# EAGLE schematic xtal_2nd_mixer (EAGLE 7.2.0)
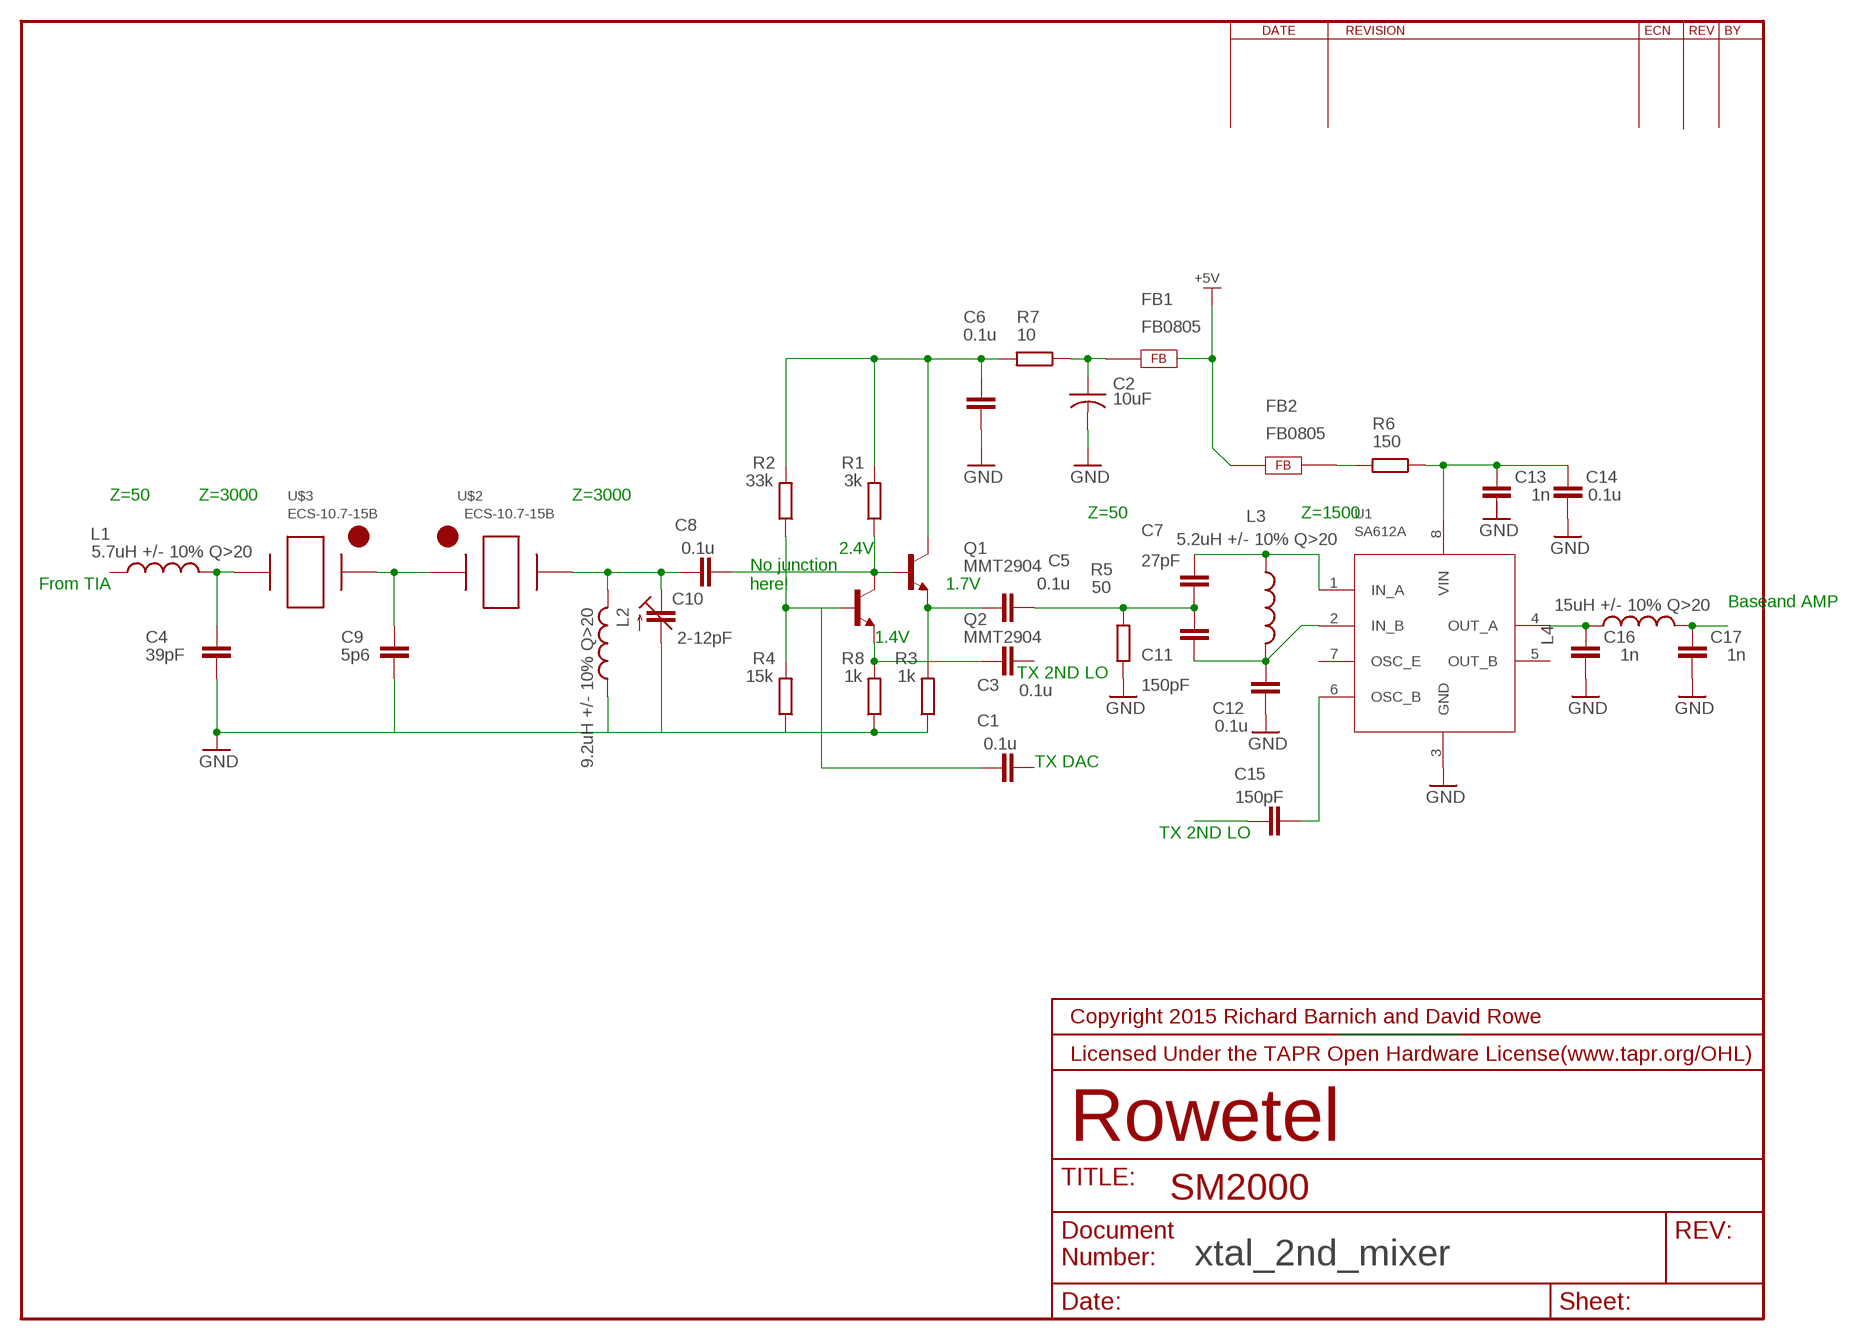
[diagram p0: schematic, sheet 1]

## Parts
C1  0.1u  C-EU025-024X044  [C025-024X044]
C2  10uF  CAP-1210  [C1210]
C3  0.1u  C-EU025-024X044  [C025-024X044]
C4  39pF  C-EU025-024X044  [C025-024X044]
C5  0.1u  C-EU025-024X044  [C025-024X044]
C6  0.1u  C-EU025-024X044  [C025-024X044]
C7  27pF  C-EU025-024X044  [C025-024X044]
C8  0.1u  C-EU025-024X044  [C025-024X044]
C9  5p6  C-EU025-024X044  [C025-024X044]
C10  2-12pF  C-TRIMM3008  [3008]
C11  150pF  C-EU025-024X044  [C025-024X044]
C12  0.1u  C-EU025-024X044  [C025-024X044]
C13  1n  C-EU025-024X044  [C025-024X044]
C14  0.1u  C-EU025-024X044  [C025-024X044]
C15  150pF  C-EU025-024X044  [C025-024X044]
C16  1n  C-EU025-024X044  [C025-024X044]
C17  1n  C-EU025-024X044  [C025-024X044]
FB1  FB0805  [FE0805]
FB2  FB0805  [FE0805]
L1  5.7uH +/- 10% Q>20  L-US0204/5  [0204/5]
L2  9.2uH +/- 10% Q>20  L-US0204/5  [0204/5]
L3  5.2uH +/- 10% Q>20  L-US0204/5  [0204/5]
L4  15uH +/- 10% Q>20  L-US0204/5  [0204/5]
Q1  MMT2904  -NPN-SOT23-EBC  [SOT23-EBC]
Q2  MMT2904  -NPN-SOT23-EBC  [SOT23-EBC]
R1  3k  RESISTOR_0805  [RESC2012X70N]
R2  33k  RESISTOR_0805  [RESC2012X70N]
R3  1k  RESISTOR_0805  [RESC2012X70N]
R4  15k  RESISTOR_0805  [RESC2012X70N]
R5  50  RESISTOR_0805  [RESC2012X70N]
R6  150  RESISTOR_0805  [RESC2012X70N]
R7  10  RESISTOR_0805  [RESC2012X70N]
R8  1k  RESISTOR_0805  [RESC2012X70N]
U1  SA612A  [SO-08]
U$2  ECS-10.7-15B  [HC49/S]
U$3  ECS-10.7-15B  [HC49/S]

## Nets
+12V: FB1.2 FB2.1 ; supply symbol labelled +5V
GND: C2.2 C4.2 C6.2 C9.2 C10.-(A) C12.1 C14.1 C16.1 C17.1 L2.1 R3.1 R5.1 R8.1 U1.3(GND)
N$1: C1.1 Q2.B R2.1 R4.2
N$2: C5.2 C7.1 C11.2 R5.2
N$3: C8.2 Q1.B Q2.C R1.1
N$5: C11.1 C12.2 L3.2 U1.2(IN_B)
N$6: C4.1 L1.2 U$3.1
N$7: C2.1 FB1.1 R7.1
N$8: C3.1 Q2.E R8.2
N$9: C7.2 L3.1 U1.1(IN_A)
N$10: C6.1 Q1.C R1.2 R2.2 R7.2
N$11: FB2.2 R6.2
N$12: C9.1 U$2.2 U$3.2
N$13: C13.2 C14.2 R6.1 U1.8(VIN)
N$15: C5.1 Q1.E R3.2
N$16: C8.1 C10.+(E) L2.2 U$2.1
N$17: C15.2 U1.6(OSC_B)
N$18: C15.1
N$19: C16.2 L4.1 U1.4(OUT_A)
N$20: C17.2 L4.2
Unconnected: C1.2 C3.2 C13.1 L1.1 R4.1 U1.5(OUT_B) U1.7(OSC_E)

## Notes on the sheet
- Z=50 | Z=3000 | Z=3000
- Z=50 | Z=1500
- 2.4V
- From TIA
- No junction
  here!
- 1.7V
- Baseand AMP
- 1.4V
- TX 2ND LO
- TX DAC
- TX 2ND LO
- SM2000

## Library data of the parts
C1 C3-C9 C11-C17 = rcl:C-EU: CAPACITOR, European symbol
C2 = _RoweTel:CAP-1210
C10 = c-trimm:C-TRIMM: Trimm capacitor; OC_FARNELL: unknown; OC_NEWARK: unknown
FB1 FB2 = _RoweTel:FB0805
L1-L4 = rcl:L-US: INDUCTOR, American symbol
Q1 Q2 = transistor:*-NPN-: NPN Transistror BF959 corrected 2008.03.06
R1-R8 = AA-ipc-7351-resistor:RESISTOR_
U1 = _RoweTel:SA612A
U$2 U$3 = _RoweTel:ECS-10.7-15B